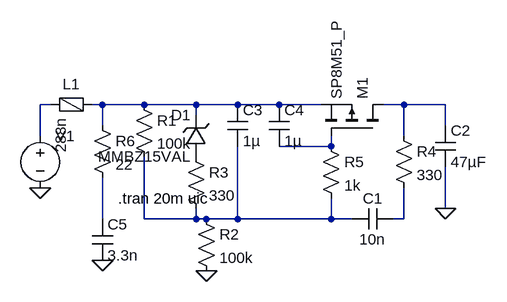
[diagram p0: schematic fet_precharge.asc]
fet_precharge.asc, the LTspice schematic file:
Version 4
SHEET 1 880 680
WIRE 32 -16 16 -16
WIRE 112 -16 96 -16
WIRE 176 -16 112 -16
WIRE 256 -16 176 -16
WIRE 320 -16 256 -16
WIRE 384 -16 320 -16
WIRE 448 -16 384 -16
WIRE 576 -16 544 -16
WIRE 640 -16 576 -16
WIRE 256 0 256 -16
WIRE 112 16 112 -16
WIRE 640 16 640 -16
WIRE 16 32 16 -16
WIRE 576 32 576 -16
WIRE 464 48 464 32
WIRE 464 48 384 48
WIRE 640 144 640 80
WIRE 112 160 112 96
WIRE 176 160 176 64
WIRE 256 160 256 144
WIRE 256 160 176 160
WIRE 272 160 256 160
WIRE 320 160 320 48
WIRE 320 160 272 160
WIRE 464 160 464 128
WIRE 464 160 320 160
WIRE 496 160 464 160
WIRE 576 160 576 112
WIRE 576 160 560 160
FLAG 16 112 0
FLAG 272 240 0
FLAG 640 144 0
FLAG 112 224 0
SYMBOL voltage 16 16 R0
WINDOW 3 24 96 Invisible 2
WINDOW 123 0 0 Left 2
WINDOW 39 24 30 Left 2
SYMATTR Value PWL(0 0 1m 0 1.0000001m 120)
SYMATTR InstName V1
SYMBOL pmos 544 32 M270
SYMATTR InstName M1
SYMATTR Value SP8M51_P
SYMBOL res 160 -32 R0
SYMATTR InstName R1
SYMATTR Value 100k
SYMBOL zener 272 64 R180
WINDOW 0 24 64 Left 2
WINDOW 3 24 0 Left 2
SYMATTR InstName D1
SYMATTR Value MMBZ15VAL
SYMBOL res 256 144 R0
SYMATTR InstName R2
SYMATTR Value 100k
SYMBOL cap 560 144 R90
WINDOW 0 0 32 VBottom 2
WINDOW 3 32 32 VTop 2
SYMATTR InstName C1
SYMATTR Value 10n
SYMBOL cap 624 16 R0
SYMATTR InstName C2
SYMATTR Value 47µF
SYMBOL res 240 48 R0
SYMATTR InstName R3
SYMATTR Value 330
SYMBOL res 560 16 R0
SYMATTR InstName R4
SYMATTR Value 330
SYMBOL res 448 32 R0
SYMATTR InstName R5
SYMATTR Value 1k
SYMBOL cap 368 -16 R0
SYMATTR InstName C4
SYMATTR Value 1µ
SYMBOL cap 304 -16 R0
SYMATTR InstName C3
SYMATTR Value 1µ
SYMBOL FerriteBead 64 -16 R90
WINDOW 0 -16 0 VBottom 2
SYMATTR InstName L1
SYMATTR Value 288n
SYMATTR SpiceLine Ipk=7 Rser=0.0033 Rpar=152 Cpar=78f mfg="Würth Elektronik" pn="74279224101 WE-MPSB 2220"
SYMBOL cap 96 160 R0
SYMATTR InstName C5
SYMATTR Value 3.3n
SYMBOL res 96 0 R0
SYMATTR InstName R6
SYMATTR Value 22
TEXT 136 128 Left 2 !.tran 20m uic

The netlist it stands for:
* fet_precharge.asc
V1 N001 0 PWL(0 0 1m 0 1.0000001m 120)
M1 N003 N004 N002 N002 SP8M51_P
R1 N002 N006 100k
D1 P001 N002 MMBZ15VAL
R2 N006 0 100k
C1 N007 N006 10n
C2 N003 0 47µF
R3 P001 N006 330
R4 N003 N007 330
R5 N004 N006 1k
C4 N002 N004 1µ
C3 N002 N006 1µ
L1 N002 N001 288n Ipk=7 Rser=0.0033 Rpar=152 Cpar=78f mfg="Würth Elektronik" pn="74279224101 WE-MPSB 2220"
C5 N005 0 3.3n
R6 N002 N005 22
.model D D
.lib standard.dio
.model NMOS NMOS
.model PMOS PMOS
.lib standard.mos
.tran 20m uic
.backanno
.end